# EAGLE design Mouse STM32F401 (EAGLE 7.5.0)
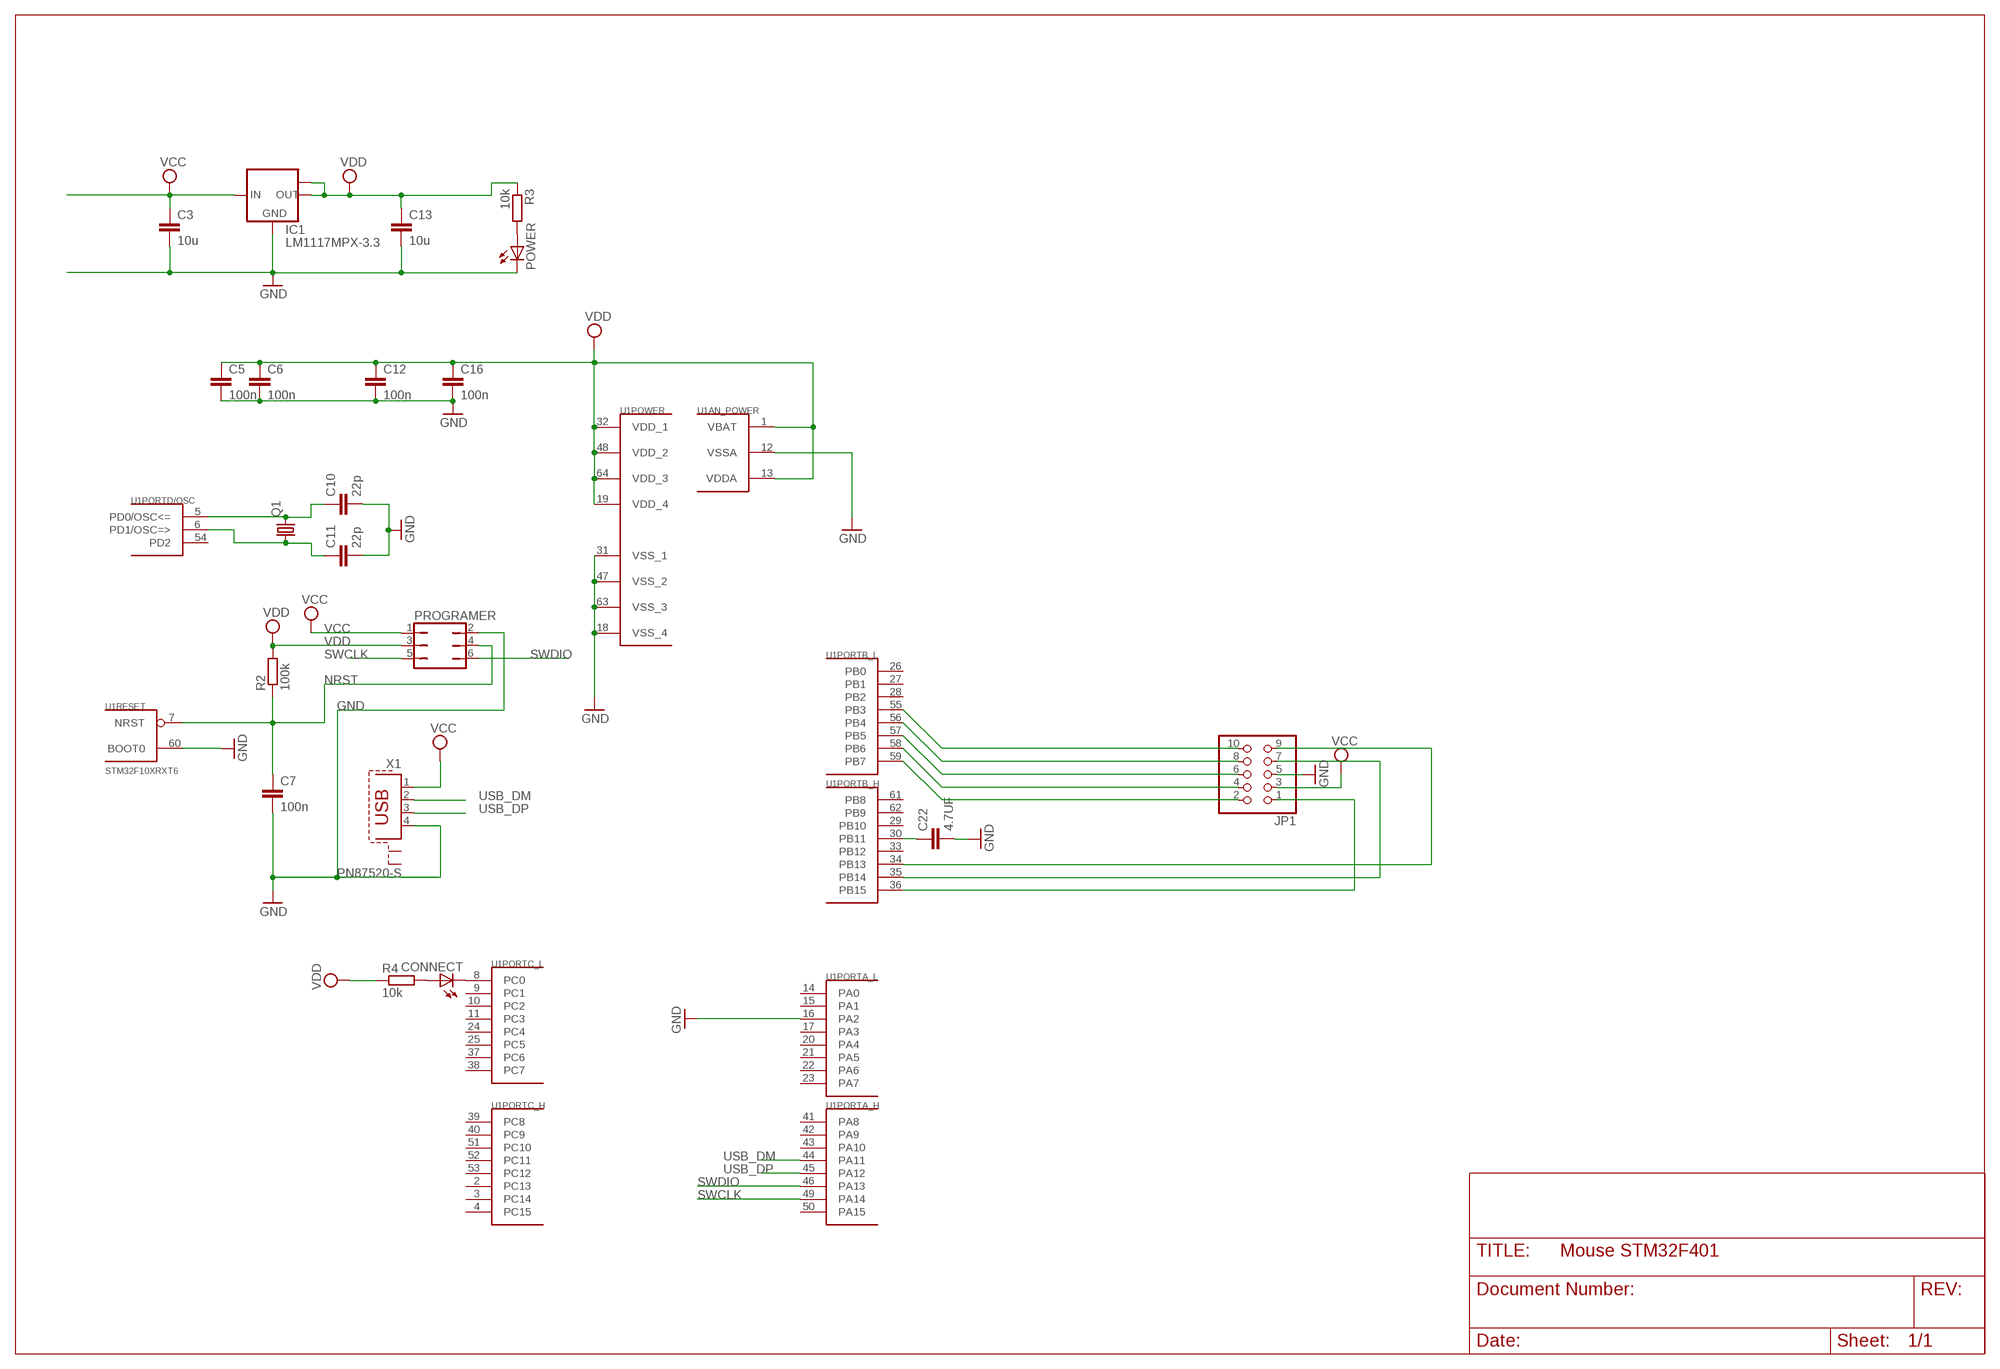
[diagram p0: schematic, sheet 1]

## Parts
C3  10u  C-EUC1206  [C1206]
C5  100n  C-EUC0603  [C0603]
C6  100n  C-EUC0603  [C0603]
C7  100n  C-EUC0603  [C0603]
C10  22p  C-EUC0603  [C0603]
C11  22p  C-EUC0603  [C0603]
C12  100n  C-EUC0603  [C0603]
C13  10u  C-EUC1206  [C1206]
C16  100n  C-EUC0603  [C0603]
C22  4.7UF  C-EUC1206  [C1206]
CONNECT  LEDSML0805  [SML0805]
IC1  LM1117MPX-3.3  [SOT223]
JP1  PINHD-2X5  [2X05]
POWER  LEDSML0805  [SML0805]
PROGRAMER  JP3Q  [JP3Q]
Q1  CRYSTALHC49S  [HC49/S]
R2  100k  R-EU_R0603  [R0603]
R3  10k  R-EU_R0603  [R0603]
R4  10k  R-EU_R0603  [R0603]
U1  STM32F10XRXT6  [TQFP64]
X1  PN87520-S  [PN87520-S]

## Nets
GND: C3.2 C5.2 C6.2 C7.2 C10.2 C11.2 C12.2 C13.2 C16.2 C22.2 IC1.1(GND) JP1.5 POWER.C PROGRAMER.2 U1.12(AN_POWER:VSSA) U1.16(PORTA_L:PA2) U1.18(POWER:VSS_4) U1.31(POWER:VSS_1) U1.47(POWER:VSS_2) U1.60(RESET:BOOT0) U1.63(POWER:VSS_3) X1.4
N$1: C10.1 Q1.2 U1.5(PORTD/OSC:PD0/OSC<=)
N$2: C11.1 Q1.1 U1.6(PORTD/OSC:PD1/OSC=>)
N$3: CONNECT.C U1.8(PORTC_L:PC0)
N$4: C22.1 U1.30(PORTB_H:PB11)
N$6: JP1.10 U1.55(PORTB_L:PB3)
N$7: CONNECT.A R4.2
N$8: JP1.8 U1.56(PORTB_L:PB4)
N$9: JP1.6 U1.57(PORTB_L:PB5)
N$10: JP1.4 U1.58(PORTB_L:PB6)
N$11: JP1.2 U1.59(PORTB_L:PB7)
N$12: POWER.A R3.2
N$13: JP1.7 U1.35(PORTB_H:PB14)
N$15: JP1.9 U1.34(PORTB_H:PB13)
N$36: JP1.1 U1.36(PORTB_H:PB15)
NRST: C7.1 PROGRAMER.4 R2.1 U1.7(RESET:NRST)
SWCLK: PROGRAMER.5 U1.49(PORTA_H:PA14)
SWDIO: PROGRAMER.6 U1.46(PORTA_H:PA13)
USB_DM: U1.44(PORTA_H:PA11) X1.2
USB_DP: U1.45(PORTA_H:PA12) X1.3
VCC: C3.1 IC1.3(IN) JP1.3 PROGRAMER.1 X1.1
VDD: C5.1 C6.1 C12.1 C13.1 C16.1 IC1.2(OUT) IC1.TAB(OUT1) PROGRAMER.3 R2.2 R3.1 R4.1 U1.1(AN_POWER:VBAT) U1.13(AN_POWER:VDDA) U1.19(POWER:VDD_4) U1.32(POWER:VDD_1) U1.48(POWER:VDD_2) U1.64(POWER:VDD_3)
Unconnected: U1.2(PORTC_H:PC13) U1.3(PORTC_H:PC14) U1.4(PORTC_H:PC15) U1.9(PORTC_L:PC1) U1.10(PORTC_L:PC2) U1.11(PORTC_L:PC3) U1.14(PORTA_L:PA0) U1.15(PORTA_L:PA1) U1.17(PORTA_L:PA3) U1.20(PORTA_L:PA4) U1.21(PORTA_L:PA5) U1.22(PORTA_L:PA6) U1.23(PORTA_L:PA7) U1.24(PORTC_L:PC4) U1.25(PORTC_L:PC5) U1.26(PORTB_L:PB0) U1.27(PORTB_L:PB1) U1.28(PORTB_L:PB2) U1.29(PORTB_H:PB10) U1.33(PORTB_H:PB12) U1.37(PORTC_L:PC6) U1.38(PORTC_L:PC7) U1.39(PORTC_H:PC8) U1.40(PORTC_H:PC9) U1.41(PORTA_H:PA8) U1.42(PORTA_H:PA9) U1.43(PORTA_H:PA10) U1.50(PORTA_H:PA15) U1.51(PORTC_H:PC10) U1.52(PORTC_H:PC11) U1.53(PORTC_H:PC12) U1.54(PORTD/OSC:PD2) U1.61(PORTB_H:PB8) U1.62(PORTB_H:PB9) X1.S1 X1.S2

## Library data of the parts
C3 C5-C7 C10-C13 C16 C22 = rcl:C-EU: CAPACITOR, European symbol; SPICEPREFIX: C
CONNECT POWER = led:LED: LED OSRAM: - CHIPLED LG R971, LG N971, LY N971, LG Q971, LY Q971, LO R971, LY R971 LH N974, LH R974 LS Q976, LO Q976, LY Q976 LO Q996 - Hyper CHIPLED LW Q18S LB Q993, LB Q99A, LB R99A - SideLED LS A670, LO A670, LY A670, LG A670, LP A670 LB A673, LV A673, LT A673, LW A673 LH A674 LY A675 LS A676, LA A676, LO A676, LY A676, LW A676 LS A679, LY A679, LG A679 - Hyper Micro SIDELED® LS Y876, LA Y876, LO Y876, LY Y876 LT Y87S - SmartLED LW L88C, LW L88S LB L89C, LB L89S, LG L890 LS L89K, LO L89K, LY L89K LS L896, LA L896, LO L896, LY L896 - TOPLED LS T670, LO T670, LY T670, LG T670, LP T670 LSG T670, LSP T670, LSY T670, LOP T670, LYG T670 LG T671, LOG T671, LSG T671 LB T673, LV T673, LT T673, LW T673 LH T674 LS T676, LA T676, LO T676, LY T676, LB T676, LH T676, LSB T676, LW T676 LB T67C, LV T67C, LT T67C, LS T67K, LO T67K, LY T67K, LW E67C LS E67B, LA E67B, LO E67B, LY E67B, LB E67C, LV E67C, LT E67C LW T67C LS T679, LY T679, LG T679 LS T770, LO T770, LY T770, LG T770, LP T770 LB T773, LV T773, LT T773, LW T773 LH T774 LS E675, LA E675, LY E675, LS T675 LS T776, LA T776, LO T776, LY T776, LB T776 LHGB T686 LT T68C, LB T68C - Hyper Mini TOPLED® LB M676 - Mini TOPLED Santana® LG M470 LS M47K, LO M47K, LY M47K Source: http://www.osram.convergy.de LUXEON: - LUMILED® LXK2-PW12-R00, LXK2-PW12-S00, LXK2-PW14-U00, LXK2-PW14-V00 LXK2-PM12-R00, LXK2-PM12-S00, LXK2-PM14-U00 LXK2-PE12-Q00, LXK2-PE12-R00, LXK2-PE12-S00, LXK2-PE14-T00, LXK2-PE14-U00 LXK2-PB12-K00, LXK2-PB12-L00, LXK2-PB12-M00, LXK2-PB14-N00, LXK2-PB14-P00, LXK2-PB14-Q00 LXK2-PR12-L00, LXK2-PR12-M00, LXK2-PR14-Q00, LXK2-PR14-R00 LXK2-PD12-Q00, LXK2-PD12-R00, LXK2-PD12-S00 LXK2-PH12-R00, LXK2-PH12-S00 LXK2-PL12-P00, LXK2-PL12-Q00, LXK2-PL12-R00 Source: www.luxeon.com KINGBRIGHT: KA-3528ASYC Source: www.kingbright.com
IC1 = lm1117:LM1117MPX-*
JP1 = pinhead:PINHD-2X5: PIN HEADER
PROGRAMER = jumper:JP3Q: JUMPER
Q1 = crystal:CRYSTAL: CRYSTAL; OC_FARNELL: 1667008; OC_NEWARK: unknown
R2-R4 = rcl:R-EU_: RESISTOR, European symbol; SPICEPREFIX: R
U1 = stm32:STM32F10XRXT6: STM32F101/103 64pin LQFP
X1 = con-berg:PN87520-S; OC_FARNELL: unknown; OC_NEWARK: unknown

## Board
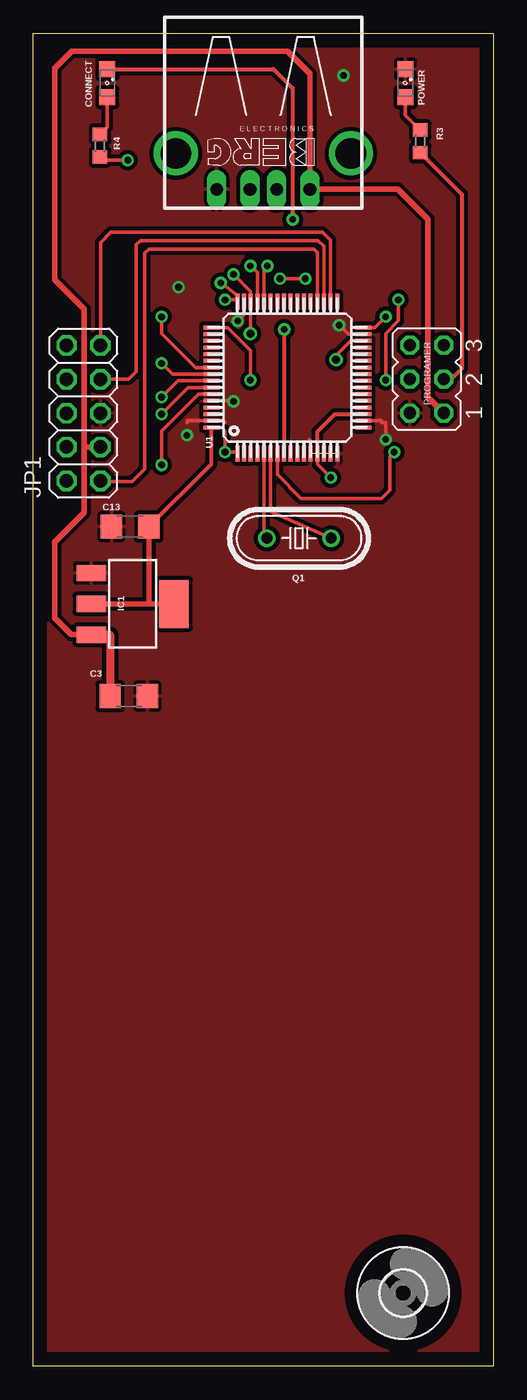
[diagram p1: board, top side]
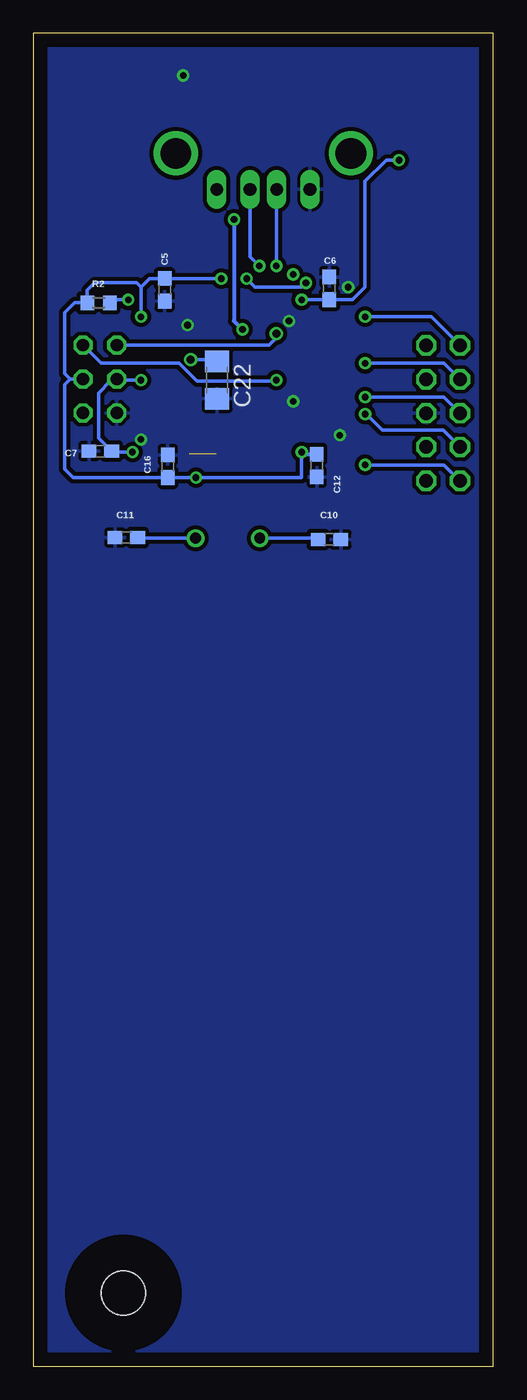
[diagram p2: board, bottom side, seen from below]

Size 34.54 x 100 mm. Coordinates in mm from the lower left corner, seen from the top.
Outline: 0,0 0,100 34.54,100 34.54,0 0,0
Copper layers (1*16): Top 0.035mm / dielectric 1.5mm / Bottom 0.035mm
Design rules "default": minimum track width 6mil, minimum drill 0.35mm, track to track 6mil, track to pad 6mil, pad to pad 6mil, via to via 6mil, smd to smd 6mil, copper to edge 40mil, drill to drill 6mil, minimum pad ring 10mil, minimum via ring 8mil, stop-mask expansion 4mil, vias tented up to drill 0mil, thermal gap 10mil

### Footprints (pad centres in the part's own frame; a part is rotated, then mirrored left to right if it is on the bottom)
C1206 = smd 1.6 x 1.8: 1 -1.4,0; 2 1.4,0
C0603 = smd 1.1 x 1: 1 -0.85,0; 2 0.85,0
SML0805 = smd 1.2 x 1.2: A 1.05,0; C -1.05,0
SOT223 = smd 1.219 x 2.235: 1 -2.311,-3.099; 2 0,-3.099; 3 2.311,-3.099 | smd 3.6 x 2.2: TAB 0,3.099
2X05 = drill 1.016 octagon: 1 -5.08,-1.27; 2 -5.08,1.27; 3 -2.54,-1.27; 4 -2.54,1.27; 5 0,-1.27; 6 0,1.27; 7 2.54,-1.27; 8 2.54,1.27; 9 5.08,-1.27; 10 5.08,1.27
JP3Q = drill 0.914 octagon: 1 -2.54,-1.27; 2 -2.54,1.27; 3 0,-1.27; 4 0,1.27; 5 2.54,-1.27; 6 2.54,1.27
HC49/S = drill 0.813: 1 -2.413,0; 2 2.413,0
R0603 = smd 1 x 1.1: 1 -0.85,0; 2 0.85,0
TQFP64 = smd 1.2 x 0.3: 1 -5.7,3.75; 2 -5.7,3.25; 3 -5.7,2.75; 4 -5.7,2.25; 5 -5.7,1.75; 6 -5.7,1.25; 7 -5.7,0.75; 8 -5.7,0.25; 9 -5.7,-0.25; 10 -5.7,-0.75; 11 -5.7,-1.25; 12 -5.7,-1.75; 13 -5.7,-2.25; 14 -5.7,-2.75; 15 -5.7,-3.25; 16 -5.7,-3.75; 33 5.7,-3.75; 34 5.7,-3.25; 35 5.7,-2.75; 36 5.7,-2.25; 37 5.7,-1.75; 38 5.7,-1.25; 39 5.7,-0.75; 40 5.7,-0.25; 41 5.7,0.25; 42 5.7,0.75; 43 5.7,1.25; 44 5.7,1.75; 45 5.7,2.25; 46 5.7,2.75; 47 5.7,3.25; 48 5.7,3.75 | smd 0.3 x 1.2: 17 -3.75,-5.7; 18 -3.25,-5.7; 19 -2.75,-5.7; 20 -2.25,-5.7; 21 -1.75,-5.7; 22 -1.25,-5.7; 23 -0.75,-5.7; 24 -0.25,-5.7; 25 0.25,-5.7; 26 0.75,-5.7; 27 1.25,-5.7; 28 1.75,-5.7; 29 2.25,-5.7; 30 2.75,-5.7; 31 3.25,-5.7; 32 3.75,-5.7; 49 3.75,5.7; 50 3.25,5.7; 51 2.75,5.7; 52 2.25,5.7; 53 1.75,5.7; 54 1.25,5.7; 55 0.75,5.7; 56 0.25,5.7; 57 -0.25,5.7; 58 -0.75,5.7; 59 -1.25,5.7; 60 -1.75,5.7; 61 -2.25,5.7; 62 -2.75,5.7; 63 -3.25,5.7; 64 -3.75,5.7
3,3 = hole 3.3: 0,0
PN87520-S = drill 0.95 long: 1 -3.5,2.71; 2 -1,2.71; 3 1,2.71; 4 3.5,2.71 | drill 2.3 pad 2.9: S1 -6.57,0; S2 6.57,0

### Placement (x,y rotation side)
C3  7.17,50.28 0 top
C5  24.67,80.75 270 bottom
C6  12.32,80.87 90 bottom
C7  29.51,68.65 180 bottom
C10  12.31,62.02 0 bottom
C11  27.56,62.17 180 bottom
C12  13.26,67.57 270 bottom
C13  7.26,62.98 180 top
C16  24.44,67.52 90 bottom
C22  20.74,73.98 270 bottom
CONNECT  5.56,96.27 270 top
IC1  7.46,57.19 270 top
JP1  3.77,71.5 90 top
POWER  27.93,96.27 270 top
PROGRAMER  29.54,74.06 90 top
Q1  19.95,62.12 180 top
R2  29.64,79.78 180 bottom
R3  29.05,91.89 90 top
R4  5.01,91.57 90 top
U1  19.07,74.18 90 top
U$1  [3,3]  27.77,5.5 0 top
X1  17.27,91 180 top

### Tracks (layer width: path | path; a pad name or v marks a point on that pad's centre or on a via)
GND  (via drill 0.5 pad 0.25)  (1 unrouted)
  Top 0.254: U1.18 26.14,70.93 26.14,70.8 26.46,70.8 v26.46,69.53 | U1.47 15.82,78.89 v15.35,78.42 | U1.31 23.64,77.43 v22.97,78.1 | U1.12 20.82,69.46 20.74,69.53 | U1.60 14.67,72.43 14.71,72.39 | 14.39,70.8 14.27,70.93 U1.63 11.54,70.93 11.54,70.8
  other vias: 23.28,96.84 10.9,80.96 11.54,69.85 15.03,72.39
  pour Bottom (isolate 0.305): 34.71,100.01 34.71,0 0.11,0 0.11,100.01
  pour Top (isolate 0.305): 34.71,100.01 34.71,0 0.11,0 0.11,100.01
N$1
  Top 0.254: U1.5 17.32,62.12 Q1.2
  Bottom 0.254: C10.1 13.27,62.12 Q1.2
N$2
  Top 0.254: U1.6 17.82,64.13 Q1.1
  Bottom 0.254: C11.1 26.66,62.12 Q1.1
N$3  (via drill 0.5 pad 0.25)
  Top 0.305: CONNECT.C 18.03,97.32 19.47,95.88 v19.47,86.04 | v18.84,77.79 18.82,77.76 U1.8
  Bottom 0.305: v19.47,86.04 19.47,78.42 v18.84,77.79
N$4  (via drill 0.6 pad 0.25)
  Top 0.254: U1.30 23.86,76.93 22.73,75.84 v22.73,75.52
  Bottom 0.254: C22.1 20.89,75.52 v22.73,75.52
N$6  (via drill 0.5 pad 0.25)
  Top 0.254: v9.63,78.74 9.63,77.47 12.17,74.93 U1.55
  Bottom 0.254: JP1.10 4.66,78.74 v9.63,78.74
N$7
  Top 0.254: CONNECT.A 5.56,92.97 R4.2
N$8  (via drill 0.5 pad 0.25)
  Top 0.254: v9.63,75.25 10.45,74.43 U1.56
  Bottom 0.254: JP1.8 3.71,75.25 v9.63,75.25
N$9  (via drill 0.5 pad 0.25)
  Top 0.254: v9.63,72.71 10.85,73.93 U1.57
  Bottom 0.254: JP1.6 3.71,72.71 v9.63,72.71
N$10  (via drill 0.5 pad 0.25)
  Top 0.254: U1.58 11.62,73.43 v9.63,71.44
  Bottom 0.254: JP1.4 3.76,70.22 8.33,70.22 9.54,71.44 v9.63,71.44
N$11  (via drill 0.5 pad 0.25)
  Top 0.254: v9.63,67.63 9.63,70.17 12.39,72.93 U1.59
  Bottom 0.254: JP1.2 3.71,67.63 v9.63,67.63
N$12
  Top 0.254: POWER.A 27.93,93.86 R3.2
N$13
  Top 0.254: U1.35 21.82,84.01 21.38,84.45 8.04,84.45 7.73,84.14 7.73,74.61 7.16,74.04 JP1.7
N$15
  Top 0.254: U1.34 22.32,84.47 21.7,85.09 5.82,85.09 5.04,84.31 JP1.9
N$36
  Top 0.254: U1.36 21.32,83.56 21.06,83.82 8.68,83.82 8.36,83.5 8.36,67.31 7.41,66.36 5.11,66.36 JP1.1
NRST  (via drill 0.5 pad 0.25)
  Top 0.254: U1.7 18.32,66.88 20.11,65.09 26.14,65.09 26.78,65.72 26.78,68.26 v27.09,68.58 | v26.46,73.98 26.46,77.48 27.41,78.43 v27.41,80.01
  Bottom 0.254: v27.09,68.58 28.58,68.58 C7.1 29.63,69.63 29.63,73.02 28.77,73.89 28.77,74.06 PROGRAMER.4 28.13,74.06 28.05,73.98 v26.46,73.98 | R2.1 28.79,79.48 28.26,80.01 v27.41,80.01
SWCLK  (via drill 0.5 pad 0.25)
  Top 0.254: U1.49 14.57,77.93 16.3,76.2 v16.3,73.98
  Bottom 0.254: PROGRAMER.5 29.46,75.25 23.59,75.25 22.24,73.9 16.37,73.9 v16.3,73.98
SWDIO  (via drill 0.5 pad 0.25, 0.6 pad 0.25)
  Top 0.254: v15.03,81.91 16.32,80.62 U1.46 16.32,77.8 v16.3,77.47
  Bottom 0.254: PROGRAMER.6 16.85,76.6 16.3,77.15 v16.3,77.47
USB_DM  (via drill 0.5 pad 0.25)
  Top 0.254: v17.57,82.55 17.32,82.3 U1.44
  Bottom 0.254: X1.2 18.27,83.25 v17.57,82.55
USB_DP  (via drill 0.5 pad 0.25)
  Top 0.254: v16.3,82.55 16.82,82.03 U1.45
  Bottom 0.254: X1.3 16.3,88.26 v16.3,82.55
VCC
  Top 0.406: PROGRAMER.1 29.63,72.7 29.63,86.04 27.38,88.29 X1.1 20.77,96.96 19.07,98.66 2.87,98.66 1.6,97.39 1.6,81.52 3.83,79.3 3.83,68.82 | 3.83,68.82 3.83,64.06 1.6,61.83 1.6,56.12 2.84,54.88 IC1.3 | JP1.3 3.97,68.96 arc90 3.83,68.82
  Top 0.61: IC1.3 5.77,54.88 C3.1
VDD  (via drill 0.5 pad 0.25)
  Top 0.254: v14.39,80.01 15.19,80.01 U1.48 15.35,79.85 15.35,80.33 v14.08,81.28 | U1.13 21.32,67.69 v22.33,66.67 | v7.09,90.49 5.25,90.49 R4.1 | U1.19 | U1.32 25.65,77.93 v26.46,78.74 | v18.52,81.6 v20.43,81.6 | U1.64 14.13,70.43 14.39,70.17 v14.39,68.58 15.22,68.58 U1.1
  Top 0.305: C13.1 13.37,67.68 U1.64 | U1.13 21.32,70.12 22.63,71.43 U1.19 | R3.1 32.17,87.92 32.17,74.85 31.38,74.06 PROGRAMER.3
  Top 0.406: IC1.2 8.68,57.19 | 8.68,57.19 IC1.TAB | C13.1 8.68,62.96 8.68,57.19
  Bottom 0.254: v14.39,80.01 14.38,80.02 C6.1 10.57,80.02 9.63,80.96 9.63,88.9 8.04,90.49 v7.09,90.49 | C16.1 v22.33,66.67 14.39,66.67 v14.39,68.58 | PROGRAMER.3 31.77,74.06 | 31.77,74.06 32.17,73.66 32.17,67.31 31.54,66.67 C16.1 | C16.1 | 31.77,74.06 32.17,74.46 32.17,79.06 31.45,79.78 R2.2 30.49,80.74 29.95,81.28 26.78,81.28 26.46,80.96 | v26.46,78.74 26.46,80.96 | 26.46,80.96 25.82,81.6 C5.1 v20.43,81.6 | v18.52,81.6 17.89,80.96 14.39,80.96 v14.08,81.28
  Bottom 0.305: v14.39,68.58 14.55,68.42 C12.1

### Text on the board
tValues: SWCLK | SWDIO | NRST | GND | VCC | ReAmiga 1200 Mouse USB | kulamario@yahoo.ie | 3/5/2021